# EAGLE design board (EAGLE 9.6.2)
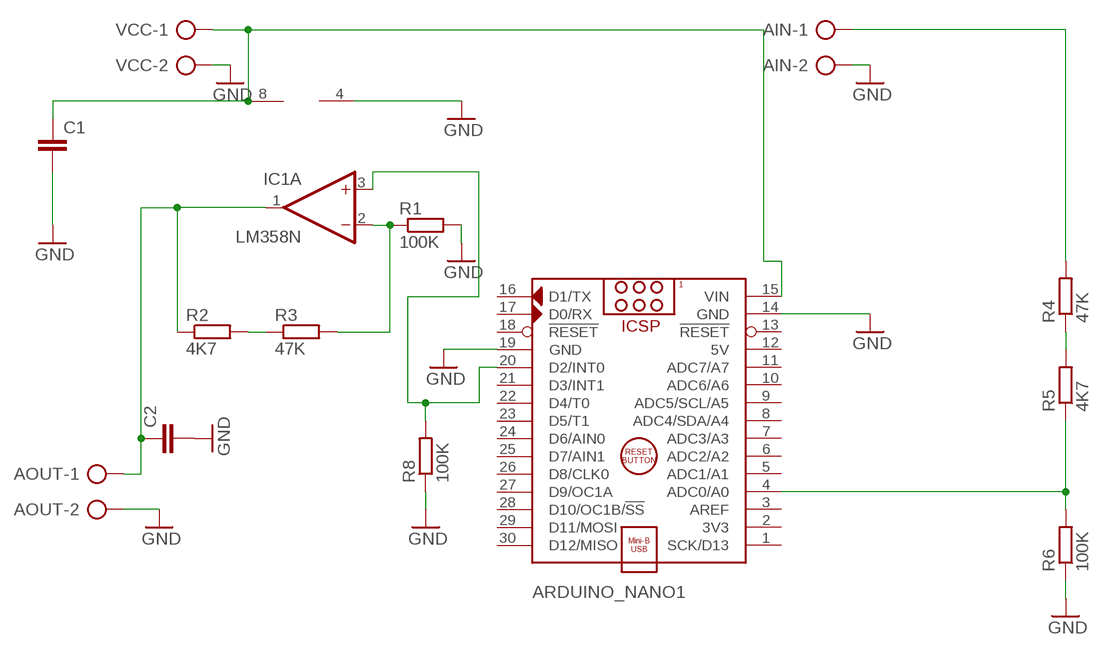
[diagram p0: schematic, sheet 1]

## Parts
AIN  AK300/2  [AK300/2]
AOUT  AK300/2  [AK300/2]
ARDUINO_NANO1  ARDUINO_NANO  [ARDUINO_NANO]
C1  C5/5  [C5B5]
C2  C5/5  [C5B5]
IC1  LM358N  [DIL08]
R1  100K  R-EU_0207/10  [0207/10]
R2  4K7  R-EU_0207/10  [0207/10]
R3  47K  R-EU_0207/10  [0207/10]
R4  47K  R-EU_0207/10  [0207/10]
R5  4K7  R-EU_0207/10  [0207/10]
R6  100K  R-EU_0207/10  [0207/10]
R8  100K  R-EU_0207/10  [0207/10]
VCC  AK300/2  [AK300/2]

## Nets
GND: AIN.2 AOUT.2 ARDUINO_NANO1.14(GND) ARDUINO_NANO1.19(GND) C1.2 C2.2 IC1.4(P:V-) R1.2 R6.1 R8.1 VCC.2
N$1: ARDUINO_NANO1.15(VIN) C1.1 IC1.8(P:V+) VCC.1
N$2: AIN.1 R4.2
N$3: IC1.2(A:-IN) R1.1 R3.2
N$4: AOUT.1 C2.1 IC1.1(A:OUT) R2.1
N$5: R2.2 R3.1
N$6: ARDUINO_NANO1.20(D2/INT0) IC1.3(A:+IN) R8.2
N$7: R4.1 R5.2
N$8: ARDUINO_NANO1.4(ADC0/A0) R5.1 R6.2
Unconnected: ARDUINO_NANO1.1(SCK/D13) ARDUINO_NANO1.2(3V3) ARDUINO_NANO1.3(AREF) ARDUINO_NANO1.5(ADC1/A1) ARDUINO_NANO1.6(ADC2/A2) ARDUINO_NANO1.7(ADC3/A3) ARDUINO_NANO1.8(ADC4/SDA/A4) ARDUINO_NANO1.9(ADC5/SCL/A5) ARDUINO_NANO1.10(ADC6/A6) ARDUINO_NANO1.11(ADC7/A7) ARDUINO_NANO1.13(!RESET) ARDUINO_NANO1.16(D1/TX) ARDUINO_NANO1.17(D0/RX) ARDUINO_NANO1.18(!RESET) ARDUINO_NANO1.21(D3/INT1) ARDUINO_NANO1.22(D4/T0) ARDUINO_NANO1.23(D5/T1) ARDUINO_NANO1.24(D6/AIN0) ARDUINO_NANO1.25(D7/AIN1) ARDUINO_NANO1.26(D8/CLK0) ARDUINO_NANO1.27(D9/OC1A) ARDUINO_NANO1.28(D10/OC1B/!SS) ARDUINO_NANO1.29(D11/MOSI) ARDUINO_NANO1.30(D12/MISO) IC1.5(B:+IN) IC1.6(B:-IN) IC1.7(B:OUT)

## Power pins joined to a net without a drawn wire
5V: ARDUINO_NANO1.12(5V)

## Library data of the parts
AIN AOUT VCC = con-ptr500:AK300/2: CONNECTOR; OC_FARNELL: unknown; OC_NEWARK: unknown
ARDUINO_NANO1 = ArduinoNanoV30:ARDUINO_NANO: Arduino Nano V3.0 Module Overview: The Arduino Nano is a small, complete, and breadboard-friendly board based on the ATmega328 (Arduino Nano 3.x) or ATmega168 (Arduino Nano 2.x). It has more or less the same functionality of the Arduino Duemilanove, but in a different package. It lacks only a DC power jack, and works with a Mini-B USB cable instead of a standard one. The Nano was designed and is being produced by Gravitech <http://www.gravitech.us/arna30wiatp.html>. General specifications: Item Value Microcontroller Atmel ATmega168 or ATmega328 Operating Voltage (logic level) 5 V Input Voltage (recommended) 7-12 V Input Voltage (limits) 6-20 V Digital I/O Pins 14 (of which 6 provide PWM output) Analog Input Pins 8 DC Current per I/O Pin 40 mA Flash Memory 16 KB (ATmega168) or 32 KB (ATmega328) of which 2 KB used by bootloader SRAM 1 KB (ATmega168) or 2 KB (ATmega328) EEPROM 512 bytes (ATmega168) or 1 KB (ATmega328) Clock Speed 16 MHz Dimensions (Inches) 0.73" x 1.70" Dimensions (mm) 18mm x 45mm Overall height About 9 mm (not including pins) Weigth 5 g Power: The Arduino Nano can be powered via the Mini-B USB connection, 6-20V unregulated external power supply (pin 30), or 5V regulated external power supply (pin 27). The power source is automatically selected to the highest voltage source. Memory: The ATmega168 has 16 KB of flash memory for storing code (of which 2 KB is used for the bootloader); the ATmega328 has 32 KB, (also with 2 KB used for the bootloader). The ATmega168 has 1 KB of SRAM and 512 bytes of EEPROM (which can be read and written with the EEPROM library); the ATmega328 has 2 KB of SRAM and 1 KB of EEPROM. Input and Output: Each of the 14 digital pins on the Nano can be used as an input or output, using pinMode(), digitalWrite(), and digitalRead() functions. They operate at 5 volts. Each pin can provide or receive a maximum of 40 mA and has an internal pull-up resistor (disconnected by default) of 20-50 kOhms. In addition, some pins have specialized functions. Visit Arduino - ArduinoBoardNano <https://www.arduino.cc/en/Main/ArduinoBoardNano>
C1 C2 = capacitor-wima:C: CAPACITOR naming: grid - package width
IC1 = DIL14LM324N:LM358: OP AMP also LM158; LM258; LM2904 Source: http://cache.national.com/ds/LM/LM158.pdf
R1-R6 R8 = rcl:R-EU_: RESISTOR, European symbol; SPICEPREFIX: R

## Board
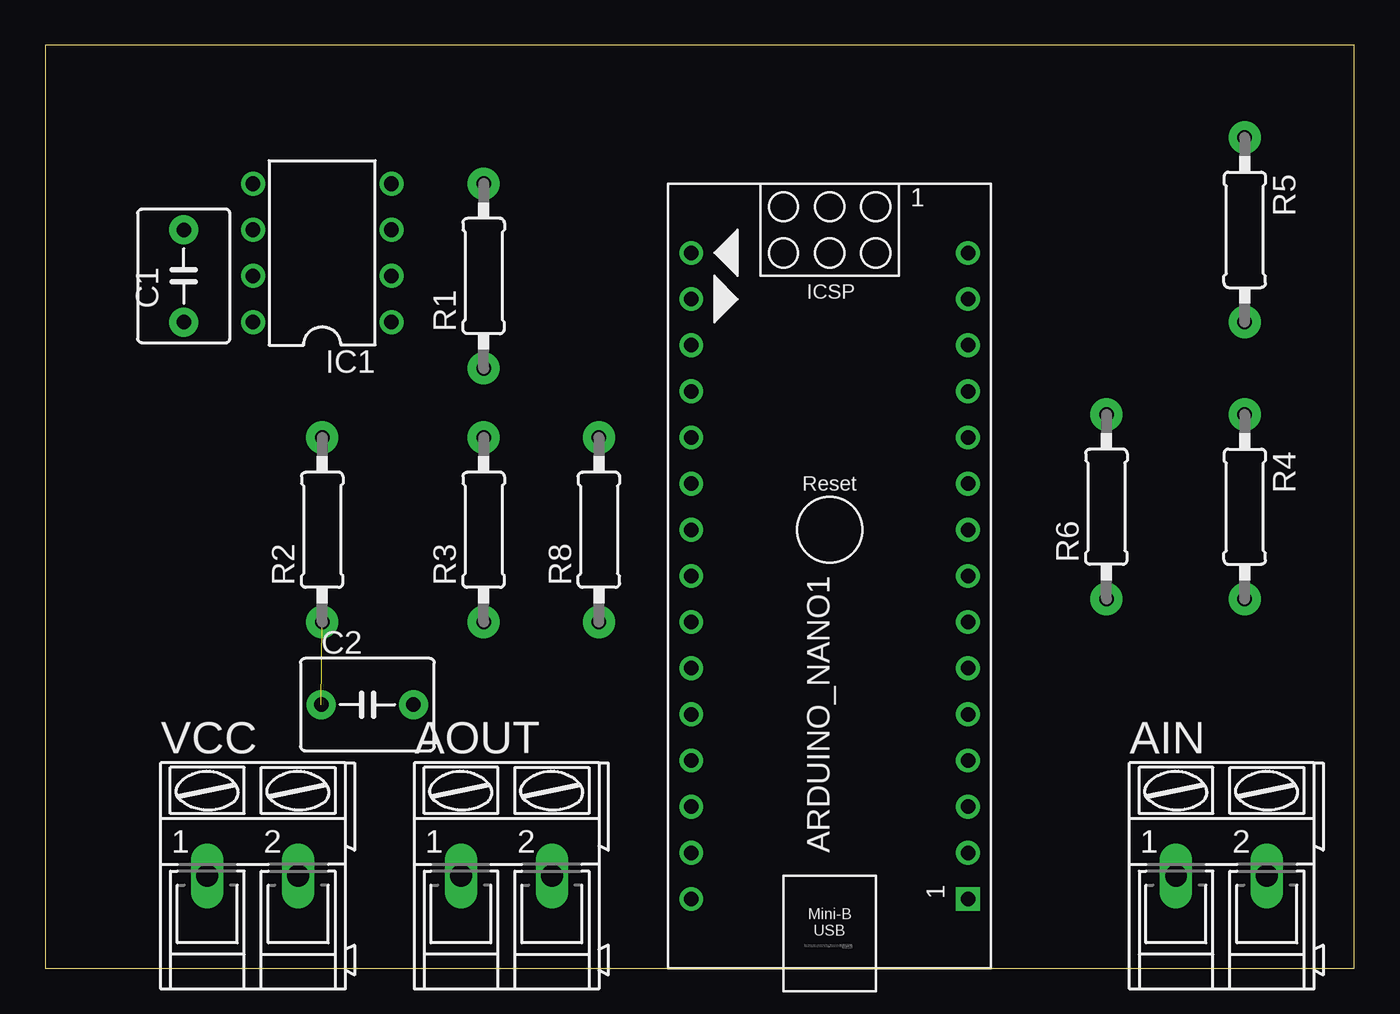
[diagram p1: board, top side]
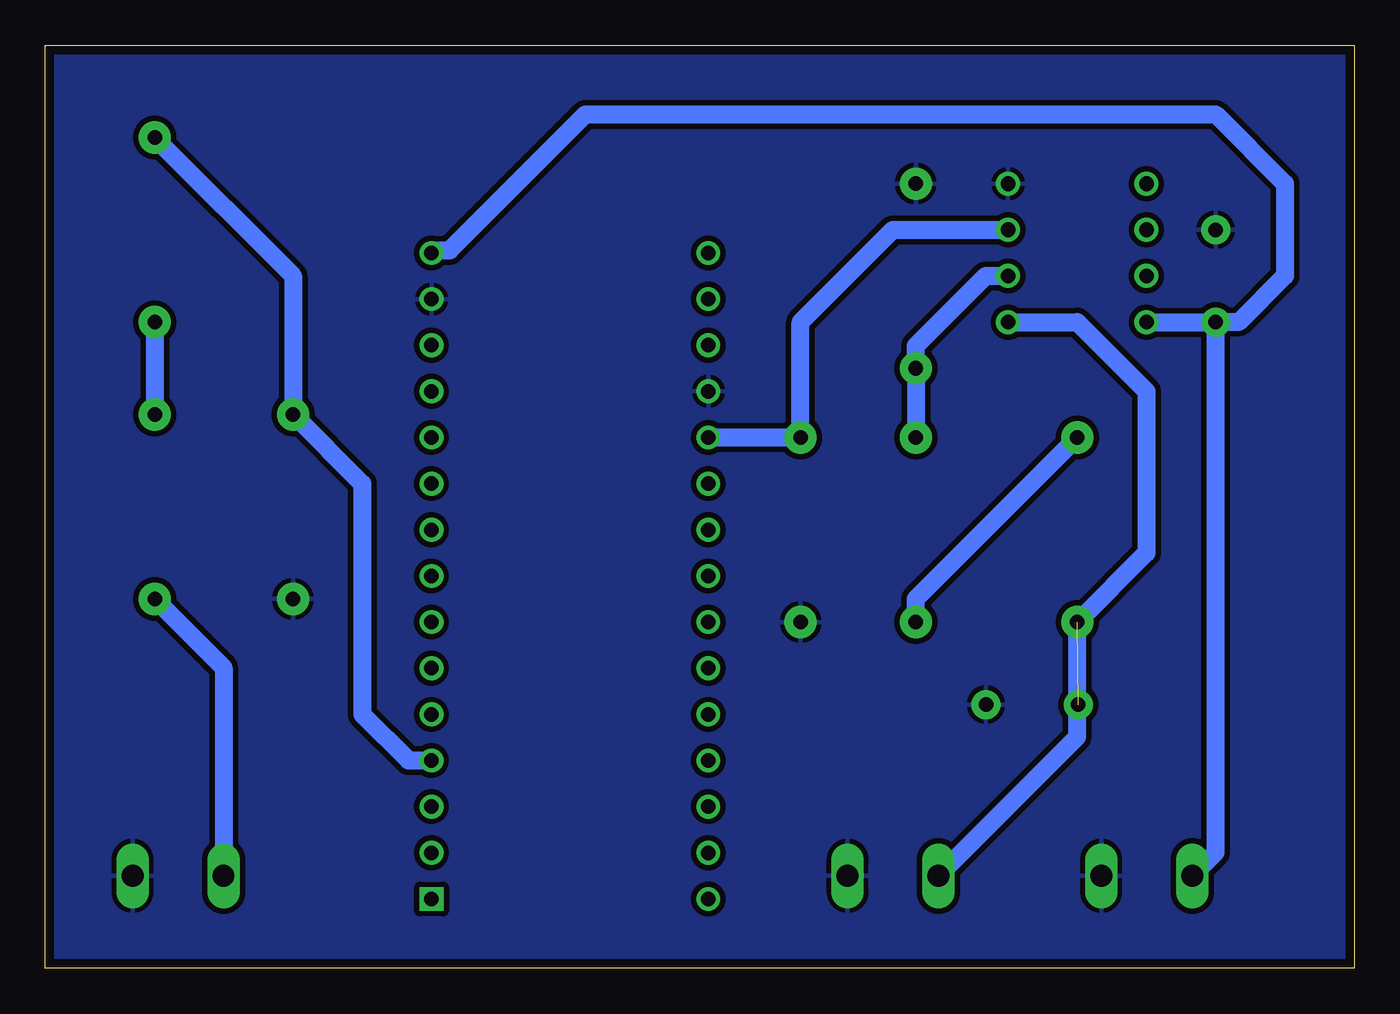
[diagram p2: board, bottom side, seen from below]

Size 72.06 x 50.79 mm. Coordinates in mm from the lower left corner, seen from the top.
Outline: 0,0 72.06,0 72.06,50.79 0,50.79 0,0
Copper layers (1*16): Top 0.035mm / dielectric 1.5mm / Bottom 0.035mm
Design rules "default *": minimum track width 6mil, minimum drill 0.8mm, track to track 0.3mm, track to pad 0.3mm, pad to pad 0.3mm, via to via 0.3mm, smd to smd 0.3mm, copper to edge 0.5mm, drill to drill 6mil, minimum pad ring 10mil, minimum via ring 8mil, stop-mask expansion 4mil, vias tented up to drill 0mil, thermal gap 10mil

### Footprints (pad centres in the part's own frame; a part is rotated, then mirrored left to right if it is on the bottom)
AK300/2 = drill 1.2 long: 1 -2.515,0; 2 2.489,0
ARDUINO_NANO = drill 0.8 square: 1 -20.32,-7.62 | drill 0.8: 2 -17.78,-7.62; 3 -15.24,-7.62; 4 -12.7,-7.62; 5 -10.16,-7.62; 6 -7.62,-7.62; 7 -5.08,-7.62; 8 -2.54,-7.62; 9 0,-7.62; 10 2.54,-7.62; 11 5.08,-7.62; 12 7.62,-7.62; 13 10.16,-7.62; 14 12.7,-7.62; 15 15.24,-7.62; 16 15.24,7.62; 17 12.7,7.62; 18 10.16,7.62; 19 7.62,7.62; 20 5.08,7.62; 21 2.54,7.62; 22 0,7.62; 23 -2.54,7.62; 24 -5.08,7.62; 25 -7.62,7.62; 26 -10.16,7.62; 27 -12.7,7.62; 28 -15.24,7.62; 29 -17.78,7.62; 30 -20.32,7.62
C5B5 = drill 0.8 pad 1.6: 1 -2.54,0; 2 2.54,0
DIL08 = drill 0.813 pad 1.27: 1 -3.81,-3.81; 2 -1.27,-3.81; 3 1.27,-3.81; 4 3.81,-3.81; 5 3.81,3.81; 6 1.27,3.81; 7 -1.27,3.81; 8 -3.81,3.81
0207/10 = drill 0.8 pad 1.778: 1 -5.08,0; 2 5.08,0

### Placement (x,y rotation side)
AIN  64.77,5.08 0 top
AOUT  25.4,5.08 0 top
ARDUINO_NANO1  43.18,24.13 90 top
C1  7.62,38.1 90 top
C2  17.73,14.51 0 top
IC1  15.24,39.37 90 top
R1  24.13,38.1 90 top
R2  15.24,24.13 90 top
R3  24.13,24.13 90 top
R4  66.04,25.4 270 top
R5  66.04,40.64 270 top
R6  58.42,25.4 90 top
R8  30.48,24.13 90 top
VCC  11.43,5.08 0 top

### Tracks (layer width: path | path; a pad name or v marks a point on that pad's centre or on a via)
GND
  pour Bottom: 0,0 0,50.8 72.39,50.8 72.39,0
N$1
  Bottom 1: IC1.8 C1.1 | VCC.1 7.62,6.38 C1.1 | ARDUINO_NANO1.15 50.66,39.51 49.8,39.51 42.32,46.99 7.62,46.99 3.81,43.18 3.81,38.1 6.35,35.56 C1.1
N$2
  Bottom 1: R4.2 62.26,16.54 AIN.1
N$3
  Bottom 1: R3.2 R1.1 24.13,34.25 20.28,38.1 IC1.2
N$4  (1 unrouted)
  Bottom 1: AOUT.1 15.24,12.72 R2.1 11.43,22.86 11.43,31.75 15.24,35.56 IC1.1
N$5
  Bottom 1: R3.1 24.13,20.32 R2.2
N$6
  Bottom 1: IC1.3 25.4,40.64 30.48,35.56 R8.2 ARDUINO_NANO1.20
N$7
  Bottom 1: R5.2 R4.1
N$8
  Bottom 1: R5.1 58.42,38.1 R6.2 54.61,26.67 54.61,13.97 52.07,11.43 ARDUINO_NANO1.4